# Altium schematic sheet Power.SchDoc
size A4
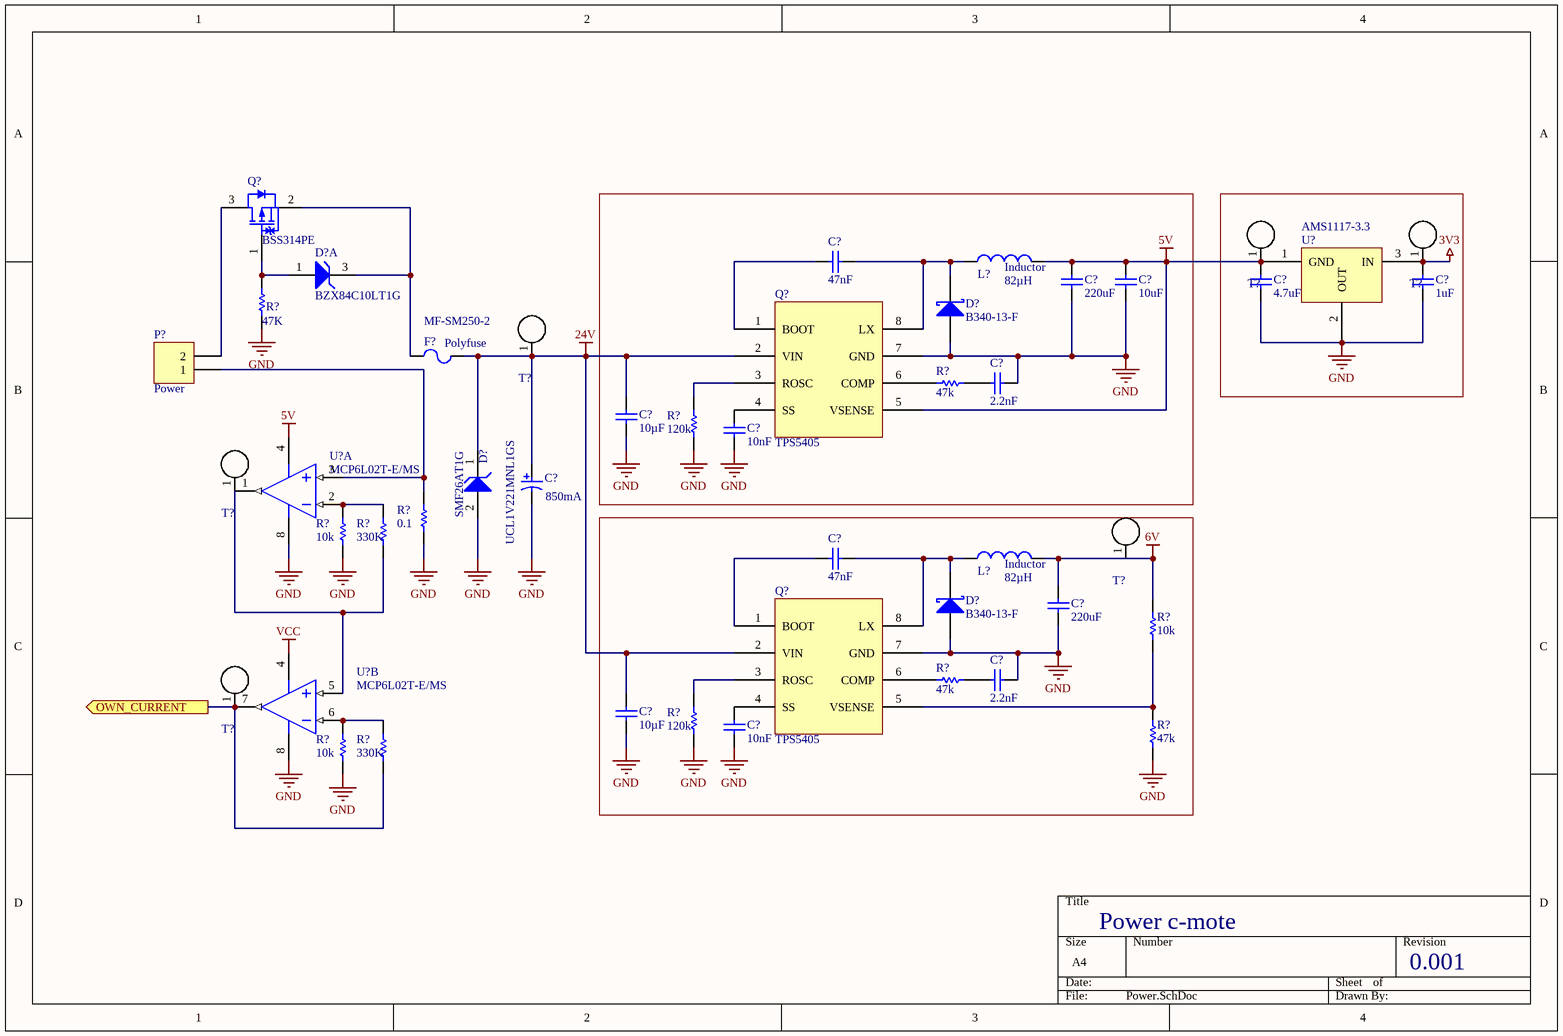
[diagram p0: Power.SchDoc]

## Parts
(Parts that share a designator on the sheet are numbered #1, #2 ... from top to bottom, then left to right.)
C?#1  value 47nF  [CAPC0805(2012)145_M]  (hidden comment: CAP 1uF 10V 0805(2012))
C?#2  value 220uF  [CAPC0805(2012)145_M]  (hidden comment: CAP 1uF 10V 0805(2012))
C?#3  value 10uF  [CAPC0805(2012)145_M]  (hidden comment: CAP 1uF 10V 0805(2012))
C?#4  value 4.7uF  [CAPC0805(2012)145_M]  (hidden comment: CAP 1uF 10V 0805(2012))
C?#5  value 1uF  [CAPC0805(2012)145_M]  (hidden comment: CAP 1uF 10V 0805(2012))
C?#6  value 2.2nF  [CAPC0805(2012)145_M]  (hidden comment: CAP 1uF 10V 0805(2012))
C?#7  value 10µF  [CAPC0805(2012)145_M]  (hidden comment: CAP 1uF 10V 0805(2012))
C?#8  value 10nF  [CAPC0805(2012)145_M]  (hidden comment: CAP 1uF 10V 0805(2012))
C?#9  UCL1V221MNL1GS  Rated Ripple Current (at 100kHz): 850mA  [NIC-CAPA2-8X10_V]
C?#10  value 47nF  [CAPC0805(2012)145_M]  (hidden comment: CAP 1uF 10V 0805(2012))
C?#11  value 220uF  [CAPC0805(2012)145_M]  (hidden comment: CAP 1uF 10V 0805(2012))
C?#12  value 2.2nF  [CAPC0805(2012)145_M]  (hidden comment: CAP 1uF 10V 0805(2012))
C?#13  value 10µF  [CAPC0805(2012)145_M]  (hidden comment: CAP 1uF 10V 0805(2012))
C?#14  value 10nF  [CAPC0805(2012)145_M]  (hidden comment: CAP 1uF 10V 0805(2012))
D?#1  BZX84C10LT1G  [ONSC-SOT-23-3-318-08_V]  (part A of 2)
D?#2  B340-13-F  [SMB]
D?#3  SMF26AT1G  [ONSC-SOD-123FL-2-498_V]
D?#4  B340-13-F  [SMB]
F?  Polyfuse  PartNumber: MF-SM250-2  [BOUR-MF-SM250_V]
L?#1  Inductor  value 82µH  [INDC3216]
L?#2  Inductor  value 82µH  [INDC3216]
P?  Power  [HDR1X2]
Q?#1  BSS314PE  [INF-PG-SOT23_N]
Q?#2  TPS5405  [TPS5405 - duplicate]
Q?#3  TPS5405  [TPS5405 - duplicate]
R?#1  value 47K  [RESC0805(2012)_N]  (hidden comment: 47K 1% 0805(2012))
R?#2  47k  [6-0805]
R?#3  120k  [6-0805]
R?#4  0.1  [6-0805]
R?#5  10k  [6-0805]
R?#6  330K  [6-0805]
R?#7  10k  [6-0805]
R?#8  47k  [6-0805]
R?#9  120k  [6-0805]
R?#10  10k  [6-0805]
R?#11  330K  [6-0805]
R?#12  47k  [6-0805]
T?#1  Testpoint  [Testpoint]  (value not drawn)
T?#2  Testpoint  [Testpoint]  (value not drawn)
T?#3  Testpoint  [Testpoint]  (value not drawn)
T?#4  Testpoint  [Testpoint]  (value not drawn)
T?#5  Testpoint  [Testpoint]  (value not drawn)
T?#6  Testpoint  [Testpoint]  (value not drawn)
U?#1  AMS1117-3.3  [SOT223]
U?#2  MCP6L02T-E/MS  [MSOP-MS8_M]  (part A of 2)
U?#3  MCP6L02T-E/MS  [MSOP-MS8_M]  (part B of 2)

## Ports
OWN_CURRENT (out)

## Nets
3V3: C?#5.2 U?#1.3(IN)
5V: C?#2.1 C?#3.1 C?#4.2 L?#1.2 Q?#2.5(VSENSE) U?#1.1(GND) U?#2.4(VSS)
6V: C?#11.1 L?#2.2 R?#7.2
24V: C?#7.1 C?#9.1 C?#13.1 D?#3.1(K) F?.2 Q?#2.2(VIN) Q?#3.2(VIN)
GND: C?#2.2 C?#3.2 C?#4.1 C?#5.1 C?#6.1 C?#7.2 C?#8.2 C?#9.2 C?#11.2 C?#12.1 C?#13.2 C?#14.2 D?#2.1(A) D?#3.2(A) D?#4.1(A) Q?#2.7(GND) Q?#3.7(GND) R?#1.1 R?#3.2 R?#4.2 R?#5.2 R?#9.2 R?#10.2 R?#12.1 U?#1.2(OUT) U?#2.8(VDD) U?#3.8(VDD)
VCC: U?#3.4(VSS)
OWN_CURRENT: R?#11.2 U?#3.7(VOUTB) ; port OWN_CURRENT
NetC?#1_1: C?#1.1 D?#2.2(K) L?#1.1 Q?#2.8(LX)
NetC?#1_2: C?#1.2 Q?#2.1(BOOT)
NetC?#6_2: C?#6.2 R?#2.2
NetC?#8_1: C?#8.1 Q?#2.4(SS)
NetC?#10_1: C?#10.1 D?#4.2(K) L?#2.1 Q?#3.8(LX)
NetC?#10_2: C?#10.2 Q?#3.1(BOOT)
NetC?#12_2: C?#12.2 R?#8.2
NetC?#14_1: C?#14.1 Q?#3.4(SS)
NetD?#1_1: D?#1.1(A) Q?#1.1(GATE) R?#1.2
NetD?#1_3: D?#1.3(K) F?.1 Q?#1.2(SOURCE)
NetP?_1: P?.1 R?#4.1 U?#2.3(VINA+)
NetP?_2: P?.2 Q?#1.3(DRAIN)
NetQ?#2_3: Q?#2.3(ROSC) R?#3.1
NetQ?#2_6: Q?#2.6(COMP) R?#2.1
NetQ?#3_3: Q?#3.3(ROSC) R?#9.1
NetQ?#3_5: Q?#3.5(VSENSE) R?#7.1 R?#12.2
NetQ?#3_6: Q?#3.6(COMP) R?#8.1
NetR?#5_1: R?#5.1 R?#6.1 U?#2.2(VINA-)
NetR?#6_2: R?#6.2 U?#2.1(VOUTA) U?#3.5(VINB+)
NetR?#10_1: R?#10.1 R?#11.1 U?#3.6(VINB-)

Not connected (* = marked no-connect by the designer): T?#1 1; T?#2 1; T?#3 1; T?#4 1; T?#5 1; T?#6 1

## Notes on the sheet
- Power c-mote
- 0.001

## Library data of the parts
C?#1-C?#8 C?#10-C?#14 = CMP-1036-04740-1: CAP 1uF 10V ±20% 0805 (2012 Metric) Thickness 1.45mm SMD; Case-Metric: 2012; Case-EIA: 0805; Technology: SMT; Rated Voltage: 10 V; Tolerance: ±20%; Max Thickness: 1.45 mm
C?#9 = CMP-0687-00080-1: Aluminum Electrolytic Capacitor, UD Series, Low Impedance, 220 uF, 35 V, + / - 20%, -55 to 105 degC, Chip Type, 8 x 10 mm D x L, Pb-Free, Reel; Manufacturer: Nichicon; Tolerance Rated Capacitance: -20 to 20%; Rated Capacitance: 220 uF; Rated Voltage: 35 V; Packing: Dia382mm Reel; Impedance: 80mOhm; PackageDescription: 2-Pin Surface Mount Device, Diameter 8 mm, Height 10 mm, Pitch 6.5 mm; Length: 10 mm; RoHS: TRUE; PartNumber: UCL1V221MNL1GS; PackageReference: CAPAE-D8H10; Diameter: 8 mm; Mounting Technology: Surface Mount; digikey: http://www.digikey.com/product-detail/en/UCL1V221MNL1GS/493-3957-1-ND/2300384
D?#1 = CMP-1060-00877-1: Zener Voltage Regulator, 225 mW, 3-Pin SOT-23, Pb-Free, Tape and Reel; Manufacturer: On Semiconductor; ComponentLink1Description: Manufacturer URL; PartNumber: BZX84C10LT1G; ComponentLink1URL: http://www.onsemi.com/; DatasheetVersion: Rev. 17; ComponentLink2Description: Datasheet; ComponentLink3Description: Package Specification; PackageReference: SOT-23-3-318-08; ComponentLink3URL: http://www.onsemi.cn/pub_link/Collateral/318-08.PDF; Packing: Tape and Reel; RoHS: Pb-Free; PackageDescription: 3-Pin Small Outline Transistor, Body 2.92 x 1.3 mm, Pitch 0.95 mm; ComponentLink2URL: http://www.onsemi.com/pub_link/Collateral/BZX84C2V4LT1-D.PDF; Mounting Technology: Surface Mount; PackageVersion: Rev. AP, 11/2009
D?#2 D?#4 = D Schottky: Schottky Diode; Published: 8-Jun-2000; LatestRevisionDate: 17-Jul-2002; LatestRevisionNote: Re-released for DXP Platform.; PackageReference: SMB; Publisher: Altium Limited; PackageDescription: DO-214-AA/SMB; 2 C-Bend Leads; Body 5.3 x 3.6 mm, inc. leads (LxW); Code_JEDEC: DO-214-AA; Digikey: http://www.digikey.com/product-detail/en/B340-13-F/B340-FDICT-ND/768811
D?#3 = CMP-1061-00617-1: 200 W Transient Voltage Suppressor, 2-Pin SOD-123FL, Pb-Free, Tape and Reel; Manufacturer: On Semiconductor; Direction: Unidirectional; V(BR) Typ (V): 30.4; IR Max (uA): 1; ComponentLink2Description: Datasheet; PackageDescription: 2-Pin SOD, Body 1.65 x 2.7 mm; ComponentLink3Description: Package Specification; PartNumber: SMF26AT1G; ComponentLink3URL: http://www.onsemi.com/pub_link/Collateral/498-01.PDF; DatasheetVersion: Rev. 7; Mounting Technology: Surface Mount; ComponentLink1Description: Manufacturer URL; RoHS: Pb-Free; PackageReference: SOD-123FL-2-498; PackageVersion: Rev. D, 05/2013; Packing: Tape and Reel; ComponentLink2URL: http://www.onsemi.com/pub_link/Collateral/SMF5.0AT1-D.PDF; ComponentLink1URL: http://www.onsemi.com/
F? = CMP-0280-00001-1: Polyfuse, SMD 5A; Manufacturer: Bourns; Nominal Voltage: 15 V; Power Dissipation: 1.9 W; Junction Temperature: -40 to 85 degC; PackageReference: MF-SM250; Mounting Technology: Surface Mount; PackageDescription: 2-Pin SMT Fuse, 9.5 x 6.71 mm Body; ComponentLink1URL: http://www.bourns.com/; ComponentLink2Description: Datasheet; DatasheetVersion: Rev. P, 11/2010; ComponentLink1Description: Manufacturer URL; ComponentLink2URL: http://www.bourns.com/data/global/pdfs/mfsm.pdf; digikey: http://www.digikey.com/product-detail/en/MF-SM250-2/MF-SM250CT-ND/265590
L?#1 L?#2 = Inductor: Code_IEC: 1005; Published: 8-Jun-2000; LatestRevisionDate: 29-May-2009; LatestRevisionNote: IPC-7351 Footprint Added.; PackageReference: 0402-A; Publisher: Altium Limited; PackageDescription: Chip Inductor; Code_JEITA: 0402; DigiKey: http://www.digikey.com/product-detail/en/SDE1006A-820K/SDE1006A-820KCT-ND/4927194
P? = Header 2: Header, 2-Pin; LatestRevisionDate: 17-Jul-2002; LatestRevisionNote: Re-released for DXP Platform.; Publisher: Altium Limited
Q?#1 = CMP-1099-00027-1: P-Channel OptiMOS P3 Small-Signal-Transistor, -30 V VDS, -1.5 A ID, -55 to 150 degC, PG-SOT23, Reel, Green; Manufacturer: Infineon; Rth: 250 K/W; RDS (on) (max): 140 mOhm; QG: -2.9 nC; IDpuls (max): -6.1 A; RDS (on) (max) (@4.5V): 230 mOhm; Pto t (max): 0.5 W; Green: TRUE; VDS (max): -30 V; VGS(th) (max): -2 V; VGS(th) (min): -1 V; ID (max): -1.5 A; ComponentLink2URL: http://www.infineon.com/dgdl/BSS314PE_rev2.3.pdf?folderId=db3a304314dca38901154a72e3951a65&fileId=db3a304330f68606013109b696aa0084; ComponentLink3Description: Package Specification; ComponentLink1URL: http://www.infineon.com/; ComponentLink1Description: Manufacturer URL; Mounting Technology: Surface Mount; PartNumber: BSS314PE; PackageReference: PG-SOT23; PackageVersion: Apr-08; Halogen-free: TRUE; ComponentLink3URL: http://www.infineon.com/dgdl/SOT23-Package_Overview.pdf?folderId=db3a30431936bc4b0119532290053c66&fileId=db3a30431936bc4b0119533468123c85; PackageDescription: 3-Pin Small Outline Transistor Package, 2.9 x 1.3 mm Body, 0.95 mm Pitch; ComponentLink2Description: Datasheet; DatasheetVersion: Rev. 2.3; Packing: Reel
Q?#2 Q?#3 = TPS5405: Step Down Regulator
  Q?#2: Digikey: http://www.digikey.com/product-detail/en/TPS5405DR/296-30579-2-ND/3478075; PDF: http://www.ti.com/lit/ds/symlink/tps5405.pdf
R?#1 = CMP-1013-00699-1: 47K 0.125W 1% 0805 (2012 Metric)  SMD; Case-Metric: 2012; Case-EIA: 0805; Power: 0.125 W; Tolerance: 1 %; Technology: SMT
R?#2-R?#12 = ERJ6RB: Precision Thick Film Chip Resistor, 10 Ohm to 1M Ohm Range, 1% and 0.5% Tolerance, 0805 Size, 0.1 W; Published: 17-Dec-2003; LatestRevisionDate: 19-Mar-2004; LatestRevisionNote: Silkscreen size reduced.; PackageDocument: Mar-2003; PackageReference: 6-0805; Publisher: Altium Limited; Code_IPC: 2012 [0805]; ComponentLink1Description: Manufacturer Link; ComponentLink1URL: http://www.panasonic.com/industrial/components/resistive_products.htm; ComponentLink2Description: Datasheet; ComponentLink2URL: http://www.panasonic.com/industrial/components/pdf/AOA0000CE2.pdf
U?#1 = AMS1117
U?#2 U?#3 = CMP-0187-00499-2: 1 MHz, 85 μA Dual Op Amp, 8-Pin MSOP, Extended Temperature Range, Tape and Reel; ComponentLink2URL: http://ww1.microchip.com/downloads/en/DeviceDoc/22140b.pdf; PackageDescription: 8-Lead Plastic Micro Small Outline Package (MS) [MSOP]; ComponentLink1URL: http://www.microchip.com/; ComponentLink1Description: Manufacturer URL; RevisionNote: URLs added. DatasheetVersion updated.; PackageVersion: revBB, Aug-2009; ComponentLink3URL: http://www.microchip.com/stellent/groups/techpub_sg/documents/packagingspec/en012702.pdf; ComponentLink2Description: Datasheet; ComponentLink3Description: Package Specification; DatasheetVersion: revB, Sep-2011; PackageReference: MSOP-MS8